# Altium schematic sheet Power Supply Unit.SchDoc: Power Supply Unit
size A3; DrawnBy: Adrien Dos SANTOS; Organization: Altium Limited; Revision: REV 1.0; SheetNumber: 4; SheetTotal: 5; ProjectName: projname
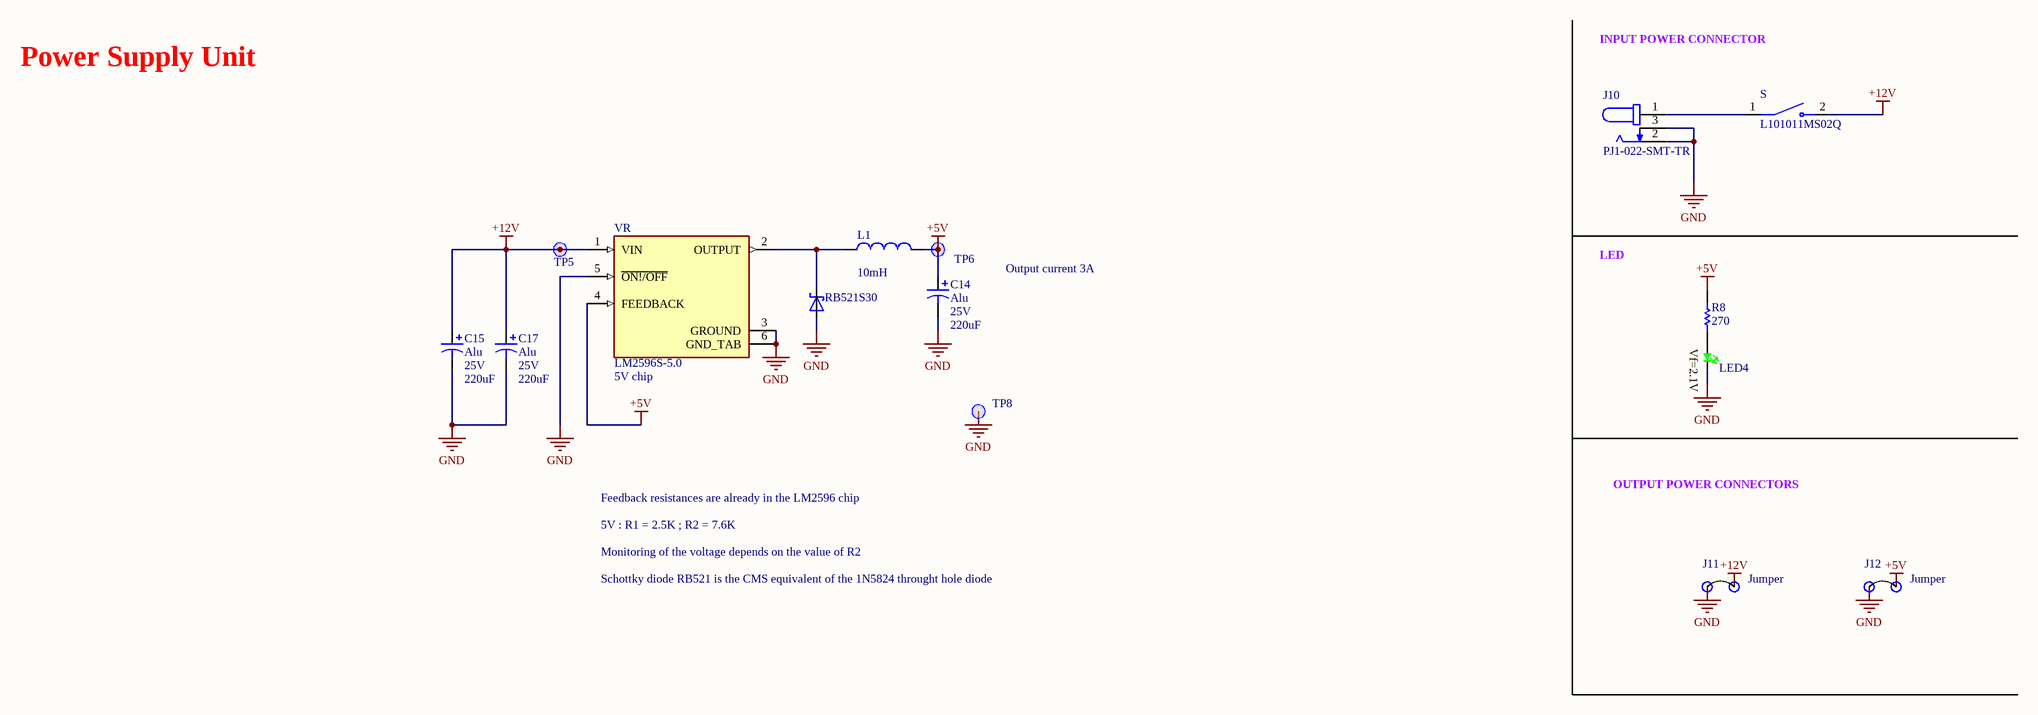
[diagram p0: Power Supply Unit.SchDoc]

## Parts
?  RB521S30  [SOD523]
C14  Alu  Voltage Rating: 25V  Capacitance: 220uF  [UUA0J471MNL1GS]
C15  Alu  Voltage Rating: 25V  Capacitance: 220uF  [UUA0J471MNL1GS]
C17  Alu  Voltage Rating: 25V  Capacitance: 220uF  [UUA0J471MNL1GS]
J10  PJ1-022-SMT-TR  [CUI_PJ1-022-SMT-TR]
J11  Jumper  [68002-102HLF]
J12  Jumper  [68002-102HLF]
L1  value 10mH  [0402-A]  (hidden comment: Inductor)
LED4  KPA-3010CGCK  [KPA-3010 GREEN]  (value not drawn)
R8  value 270  [RESC0603_N]  (hidden comment: RES)
S  L101011MS02Q  [SW_L101011MS02Q]
TP5  TEST_POINT_1.27mm  [Test_Point1.27mm]  (value not drawn)  (no BOM)
TP6  TEST_POINT_1.27mm  [Test_Point1.27mm]  (value not drawn)  (no BOM)
TP8  TEST_POINT_1.27mm  [Test_Point1.27mm]  (value not drawn)  (no BOM)
VR  LM2596S-5.0  [TO170P1524X483-6N]

## Nets
+5V: C14.1 J12.2 L1.2 R8.2 TP6.1 VR.4(FEEDBACK)
+12V: C15.1 C17.1 J11.2 S.2 TP5.1 VR.1(VIN)
GND: ?.2(A) C14.2 C15.2 C17.2 J10.2 J10.3 J11.1 J12.1 LED4.1(K) TP8.1 VR.3(GROUND) VR.5(~{ON!/OFF}) VR.6(GND_TAB)
Net?_1: ?.1(K) L1.1 VR.2(OUTPUT)
NetJ10_1: J10.1 S.1
NetLED4_2: LED4.2(A) R8.1

## Notes on the sheet
- Power Supply Unit
- INPUT POWER CONNECTOR
- Output current 3A
- LED
- (near VR) 5V chip
- Feedback resistances are already in the LM2596 chip
- OUTPUT POWER CONNECTORS
- 5V : R1 = 2.5K ; R2 = 7.6K
- Monitoring of the voltage depends on the value of R2
- Schottky diode RB521 is the CMS equivalent of the 1N5824 throught hole diode
- Title
- Size:
- Date:
- A3
- Revision:
- Time:
- Sheet
- of
- Avnet EMG France SA
- 12 rue Jean Bart
- 91120 MASSY - FR
- File:
- Drawn by :
- (in symbol KPA-3010CGCK) Vf=2.1V

## Library data of the parts
? = RB521S30: Diode Schottky 30V 200mA Surface Mount SOD-523F; MF: ON Semiconductor; Price: None; Availability: Unavailable; Package: S-9 ON Semiconductor; SnapEDA_Link: https://www.snapeda.com/parts/RB521S30/ON%20Semiconductor/view-part/1289104/?ref=snap; MP: RB521S30; Value: *
C14 C15 C17 = UUA1E221MNL1GS: CAP ALUM 220UF 20% 25V SMD; Manufacturer: Nichicon; Ripple Current: 320mA; Leakage Current: 55uA; Life (Hours): 5000Hour; Supplier 1: Digi-Key; Part Number: UUA1E221MNL1GS; Stock 1: 716; Pricing 1: 1=0,91000, 10=0,69200, 100=0,49490 (USD); RoHS: Yes; Mount: Surface Mount; Case/Package: Radial; Max Operating Temperature: 105°C; Package Quantity: 1; Tolerance: 20%; Packaging: Tape and Reel; Voltage Rating (DC): 25V; Termination: SMD/SMT; Features: General Purpose; Length: 10mm; Height - Seated (Max): 0.394inch; ComponentLink1URL: https://datasheet.ciiva.com/15036/e-ua-15036879.pdf?src-supplier=Digi-Key; ComponentLink1Description: https://datasheet.ciiva.com/15036/e-ua-15036879.pdf?src-supplier=Digi-Key; Supplier Part Number 1: 493-9451-1-ND; Currency: *; MOQ: *; Avnet part number: *
J10 = PJ1-022-SMT-TR: 0.65 x 2.8 mm, 2.5 A, Horizontal, Surface Mount _SMT_, Dc Power Jack Connector; MF: CUI Devices; SnapEDA_Link: https://www.snapeda.com/parts/PJ1-022-SMT-TR/CUI%20Devices/view-part/491023/?ref=snap; MP: PJ1-022-SMT-TR; Availability: Unavailable; Package: MSOP-8; Price: None; Value: *
J11 J12 = 68002-102HLF JMP: JUMPER Headers 2POS 2.54mm pitch for jumper; Manufacturer: Amphenol FCI; Number of Contacts: 2; Current Rating: 3A; Voltage Rating: 1.5kV; Insulation Resistance: 5GR; Gender: Male; Connector Type: Male Pin; Contact Post Length: 3.81mm; Supplier 1: Digi-Key; Part Number: 68002-102HLF; RoHS: Yes; Category: Board to Board Connectors; Stock 1: 4863; Pricing 1: 1=0,33000, 10=0,31600, 100=0,22120, 500=0,18964, 1000=0,15803, 5000=0,13545, 10000=0,12642 (USD); Mount: Through Hole; Contact Plating: Gold,GXT; Contact Material: Bronze; Color: Black; Housing Color: Black; Housing Material: Thermoplastic; Min Operating Temperature: -65°C; Max Operating Temperature: 125°C; Number of Rows: 1; Termination: Solder; Packaging: Bulk; Contact Gender: Male; Package Quantity: 100; Number of Positions: 2; Max Voltage Rating (AC): 1.5kV; Orientation: Straight; Length: 5.08mm; Pitch: 2.54mm; Contact Mating Length: 0.23inch; Depth: 2.41mm; Radiation Hardening: No; Lead Free: Lead Free; Flammability Rating: UL94 V-0; ComponentLink1URL: https://datasheet.ciiva.com/16726/68000-16726189.pdf?src-supplier=Avnet+Europe; ComponentLink1Description: https://datasheet.ciiva.com/16726/68000-16726189.pdf?src-supplier=Avnet+Europe; ComponentLink2URL: https://datasheet.ciiva.com/721/68000-721356.pdf?src-supplier=Digi-Key; ComponentLink2Description: https://datasheet.ciiva.com/721/68000-721356.pdf?src-supplier=Digi-Key
L1 = Inductor: Code_IEC: 1005; Published: 8-Jun-2000; LatestRevisionDate: 29-May-2009; LatestRevisionNote: IPC-7351 Footprint Added.; PackageReference: 0402-A; Publisher: Altium Limited; PackageDescription: Chip Inductor; Code_JEITA: 0402
LED4 = KPA-3010CGCK: 3.0 mm x 1.0 mm Green Right Angle SMD Chip LED Lamp 120°; Manufacturer: Kingbright; Part Number: APA3010CGCK; Lens Style: Clear; Dominant Wavelength: 570nm; Forward Voltage: 2.1V; Luminous Intensity: 60mcd; Test Current: 20mA; Supplier 1: Digi-Key; Stock 1: 0; Pricing 1: 2000=0.1155 (USD); Mount: Surface Mount; Case/Package: SMD/SMT; Colour: Green; Viewing Angle: 120°; Packaging: Tape and Reel; Package Quantity: 2000; Length: 3mm; Height: 1mm; Width: 2mm; Lead Free: Lead Free; Supplier Part Number 1: 754-1063-2-ND
R8 = RT0603BRE07270RL: RES 270 OHM 1/10W .1% SMD 0603; manufacturer: Yageo; currency: USD; Rated Power: 0.1W, 1/10W; smt_res_0603id: 163901; sub_category_id: 619; category_id: 33; Temperature Coefficient: ±50ppm/°C; Tolerance: ±0.1%; lead_style: Surface Mount (SMD - SMT); Value Unit: 1; MOQ: 5.000; Part Number: RT0603BRE07270RL; price: 0.11300; image: http://media.digikey.com/Renders/Yageo%20Renders/RC0603FR-0710RL_tmb.jpg; Digikey PN: RT0603BRE07270RL-ND; series: RT; composition: Thin Film; features: -; Case: 0603 (1608 metric); Size Dimension: 0.063" L x 0.031" W (1.60mm x 0.80mm); Height: 0.018" (0.45mm); packaging: Tape & Reel (TR); quantity_available: 0; datasheet: http://www.yageo.com/pdf/PYu-RT_1-to-0.05_RoHS_L_3.pdf; Normalized Value: 270; Display Value: 270; Value_in_ohm: 270
S = L101011MS02Q: Slide Switch SPST Through Hole; MF: C&K; MP: L101011MS02Q; Value: *; Availability: Unavailable; SnapEDA_Link: https://www.snapeda.com/parts/L101011MS02Q/C%26K/view-part/455586/?ref=snap; Price: None; Package: None
VR = LM2596S-5.0: SIMPLE SWITCHER&reg; 4.5V to 40V, 3A Low Component Count Step-Down Regulator 5-DDPAK/TO-263; MF: Texas Instruments; MP: LM2596S-5.0/NOPB; DigiKey-Purchase-URL: https://snapeda.com/shop?store=DigiKey&id=15588; Mouser-Purchase-URL: https://snapeda.com/shop?store=Mouser&id=15588; SnapEDA_Link: https://www.snapeda.com/parts/LM2596S-5.0/NOPB/Texas%20Instruments/view-part/15588/?ref=snap; Price: None; Value: *; Availability: Good; Texas_Instruments-Purchase-URL: https://snapeda.com/shop?store=Texas+Instruments&id=15588; Package: TO-263-5 Texas Instruments